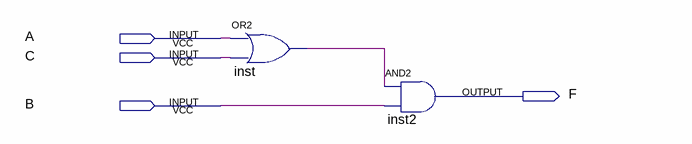
[diagram p0: schematic sheet]
// Quartus schematic step_1.bdf as structural Verilog: 2 symbols, 4 pins
module step_1 (
  input  A,
  input  C,
  input  B,
  output F
);

  wire inst_out;

  or inst (inst_out, A, C);
  and inst2 (F, inst_out, B);
endmodule
